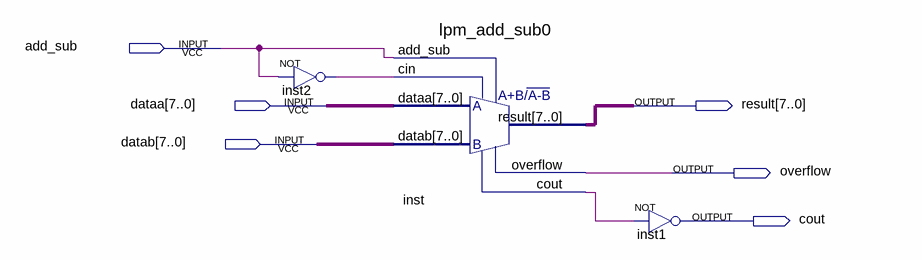
[diagram p0: schematic sheet]
// Quartus schematic Pro2_1.bdf as structural Verilog: 3 symbols, 6 pins
module Pro2_1 (
  input  add_sub,
  input  [7:0] dataa,
  input  [7:0] datab,
  output [7:0] result,
  output overflow,
  output cout
);

  wire inst2_out, inst_cout;

  not inst2 (inst2_out, add_sub);
  lpm_add_sub0 inst (
    .dataa(dataa), .datab(datab), .add_sub(add_sub), .cin(inst2_out), .result(result), .overflow(overflow),
    .cout(inst_cout));
  not inst1 (cout, inst_cout);
endmodule
